# EAGLE schematic GPIO_shield (EAGLE 8.0.1)
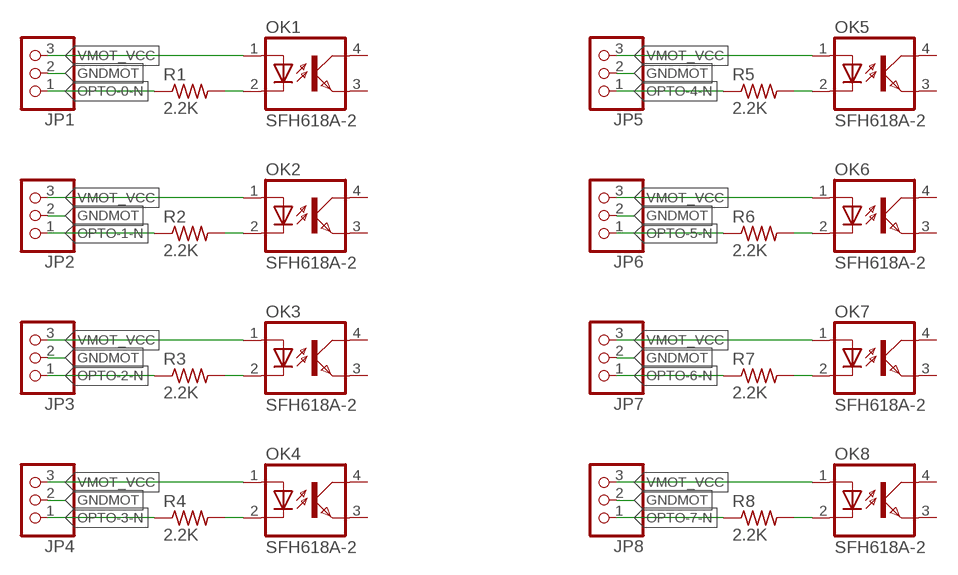
[diagram p0: schematic, sheet 1]

## Parts
JP1  PINHD-1X3  [1X03]
JP2  PINHD-1X3  [1X03]
JP3  PINHD-1X3  [1X03]
JP4  PINHD-1X3  [1X03]
JP5  PINHD-1X3  [1X03]
JP6  PINHD-1X3  [1X03]
JP7  PINHD-1X3  [1X03]
JP8  PINHD-1X3  [1X03]
OK1  SFH618A-2  [DIP4]
OK2  SFH618A-2  [DIP4]
OK3  SFH618A-2  [DIP4]
OK4  SFH618A-2  [DIP4]
OK5  SFH618A-2  [DIP4]
OK6  SFH618A-2  [DIP4]
OK7  SFH618A-2  [DIP4]
OK8  SFH618A-2  [DIP4]
R1  2.2K  R-US_0204/2V  [0204V]
R2  2.2K  R-US_0204/2V  [0204V]
R3  2.2K  R-US_0204/2V  [0204V]
R4  2.2K  R-US_0204/2V  [0204V]
R5  2.2K  R-US_0204/2V  [0204V]
R6  2.2K  R-US_0204/2V  [0204V]
R7  2.2K  R-US_0204/2V  [0204V]
R8  2.2K  R-US_0204/2V  [0204V]

## Nets
GNDMOT: JP1.2 JP2.2 JP3.2 JP4.2 JP5.2 JP6.2 JP7.2 JP8.2
N$1: OK1.2(C) R1.2
N$2: OK2.2(C) R2.2
N$3: OK3.2(C) R3.2
N$4: OK4.2(C) R4.2
N$5: OK5.2(C) R5.2
N$6: OK6.2(C) R6.2
N$7: OK7.2(C) R7.2
N$8: OK8.2(C) R8.2
OPTO-0-N: JP1.1 R1.1
OPTO-1-N: JP2.1 R2.1
OPTO-2-N: JP3.1 R3.1
OPTO-3-N: JP4.1 R4.1
OPTO-4-N: JP5.1 R5.1
OPTO-5-N: JP6.1 R6.1
OPTO-6-N: JP7.1 R7.1
OPTO-7-N: JP8.1 R8.1
VMOT_VCC: JP1.3 JP2.3 JP3.3 JP4.3 JP5.3 JP6.3 JP7.3 JP8.3 OK1.1(A) OK2.1(A) OK3.1(A) OK4.1(A) OK5.1(A) OK6.1(A) OK7.1(A) OK8.1(A)
Unconnected: OK1.3(EMIT) OK1.4(COL) OK2.3(EMIT) OK2.4(COL) OK3.3(EMIT) OK3.4(COL) OK4.3(EMIT) OK4.4(COL) OK5.3(EMIT) OK5.4(COL) OK6.3(EMIT) OK6.4(COL) OK7.3(EMIT) OK7.4(COL) OK8.3(EMIT) OK8.4(COL)

## Library data of the parts
JP1-JP8 = pinhead:PINHD-1X3: PIN HEADER
OK1-OK8 = optocoupler:SFH618?*: Optocoupler, Phototransistor Output, Low Input Current Source: Data sheet <http://www.vishay.com/docs/83673/sfh618.pdf>; MF: VISHAY/TELEFUNKEN; MPN: SFH618A-2; OC_FARNELL: 6424855; OC_NEWARK: 21H7744
R1-R8 = rcl:R-US_: RESISTOR, American symbol